# Altium schematic sheet Mounting_Holes.SchDoc
size A4; SheetNumber: 1; SheetTotal: 1
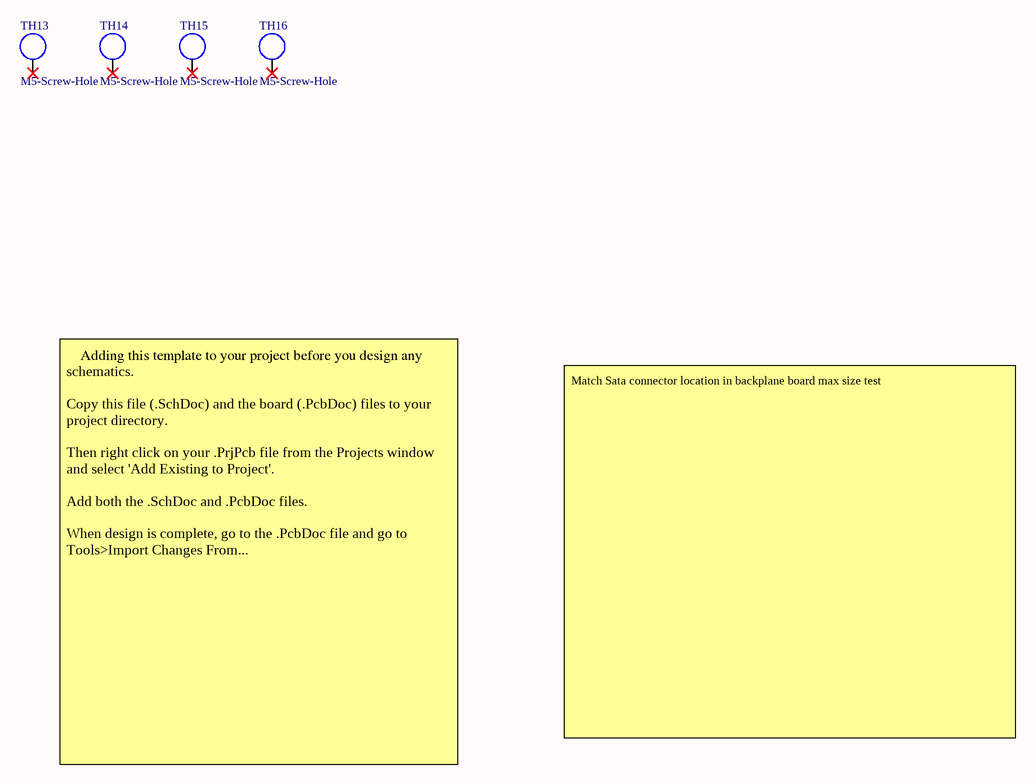
[diagram p0: Mounting_Holes.SchDoc]

## Parts
TH13  M5-Screw-Hole  [M5_Screw_Hole]
TH14  M5-Screw-Hole  [M5_Screw_Hole]
TH15  M5-Screw-Hole  [M5_Screw_Hole]
TH16  M5-Screw-Hole  [M5_Screw_Hole]

## Nets

Not connected (* = marked no-connect by the designer): TH13 1*; TH14 1*; TH15 1*; TH16 1*

## Notes on the sheet
- Match Sata connector location in backplane board max size test
- Adding this template to your project before you design any schematics.
  Copy this file (.SchDoc) and the board (.PcbDoc) files to your project directory.
  Then right click on your .PrjPcb file from the Projects window and select 'Add Existing to Project'.
  Add both the .SchDoc and .PcbDoc files.
  When design is complete, go to the .PcbDoc file and go to Tools>Import Changes From...